# Altium schematic sheet STM32.SchDoc: STM32_and_Reference_Voltage_Circuits
size 431 x 279 mm; DrawnBy: Will Mensah; SheetNumber: 2; SheetTotal: 6
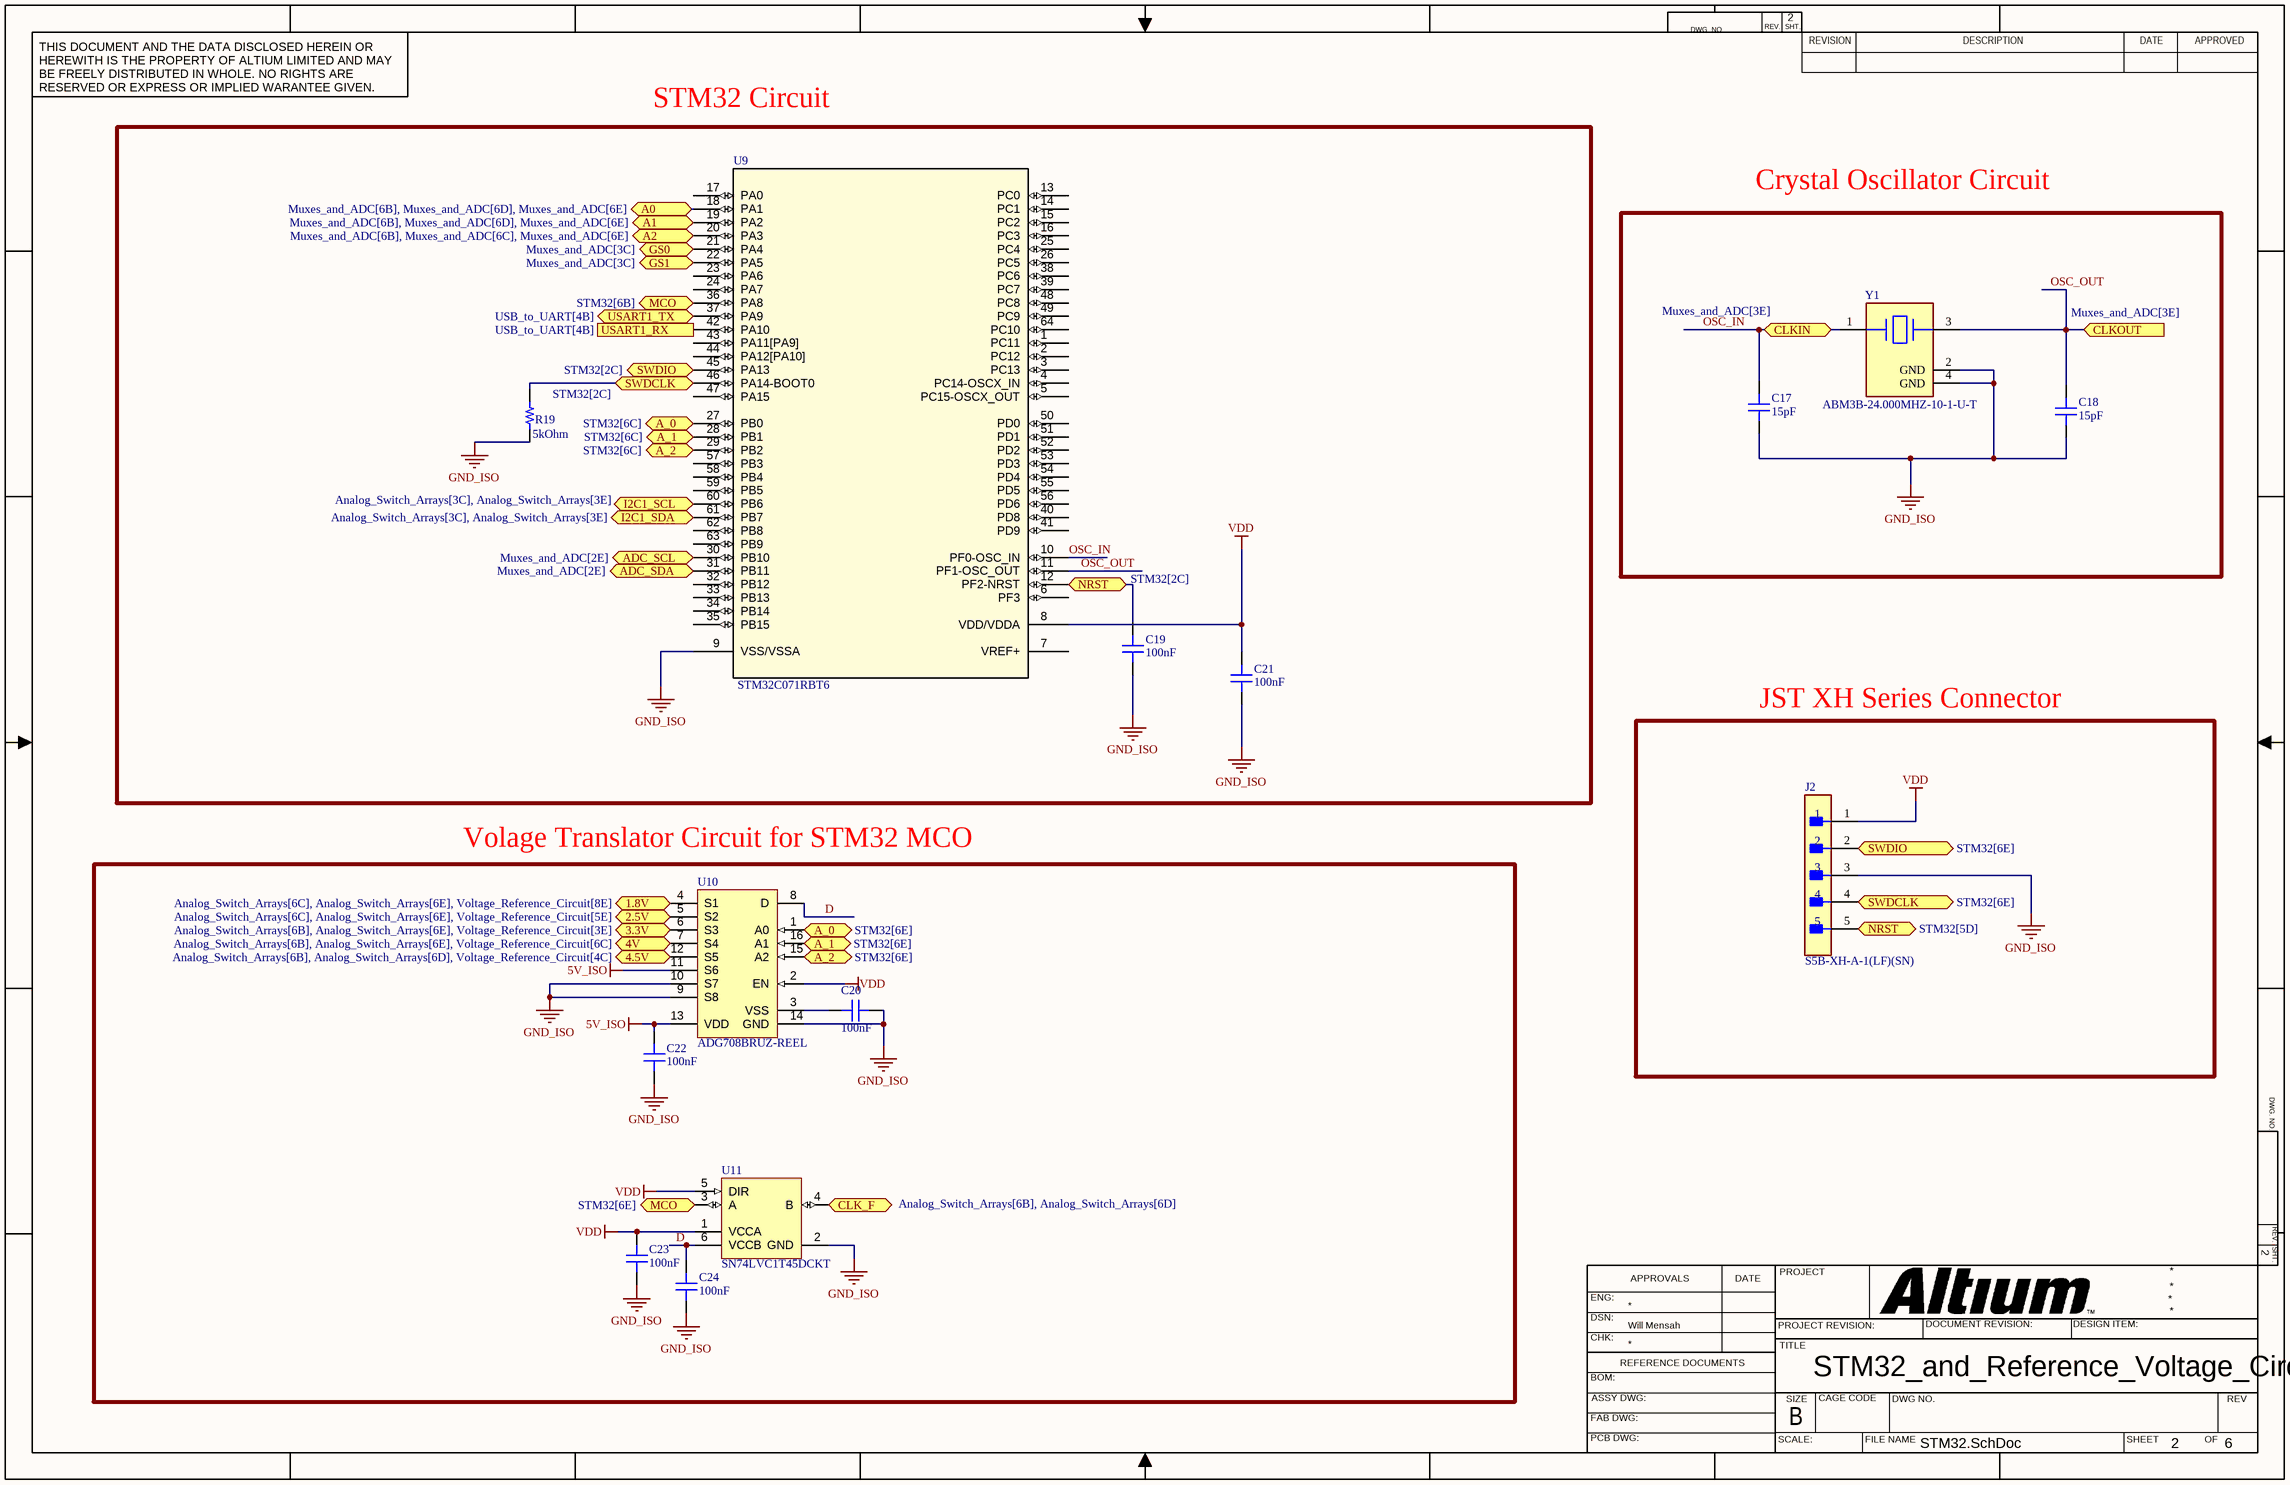
[diagram p0: STM32.SchDoc]

## Parts
C17  value 15pF  [MURATA CAP GRM31A 1206_3216]  (hidden comment: GRM31A5C2H150JW01D)
C18  value 15pF  [MURATA CAP GRM31A 1206_3216]  (hidden comment: GRM31A5C2H150JW01D)
C19  value 100nF  [MURATA CAP GCM31M 1206_3216]  (hidden comment: GCM31C5C1H104FA16L)
C20  value 100nF  [CAP 1206_3216 - 0.8MM]  (hidden comment: C1206X104G4HAC7800)
C21  value 100nF  [MURATA CAP GCM31M 1206_3216]  (hidden comment: GCM31C5C1H104FA16L)
C22  value 100nF  [CAP 1206_3216 - 0.8MM]  (hidden comment: C1206X104G4HAC7800)
C23  value 100nF  [CAP 1206_3216 - 0.8MM]  (hidden comment: C1206X104G4HAC7800)
C24  value 100nF  [CAP 1206_3216 - 0.8MM]  (hidden comment: C1206X104G4HAC7800)
J2  S5B-XH-A-1(LF)(SN)  [FP-S5B-XH-A-1_LF_SN-MFG]
R19  5kOhm  [YAGEO RES 1206_3216]
U9  STM32C071RBT6  [LQFP-64_STM]
U10  ADG708BRUZ-REEL  [ADI-RU-16_N]
U11  SN74LVC1T45DCKT  [DCK0006A_N]
Y1  ABM3B-24.000MHZ-10-1-U-T  [FP-ABM3B-MFG]

## Blocks framed on the sheet
STM32 Circuit: C19 C21 R19 U9
Crystal Oscillator Circuit: C17 C18 Y1
JST XH Series Connector: J2
Volage Translator Circuit for STM32 MCO: C20 C22-C24 U10 U11

## Ports
1.8V (bidir, see Analog_Switch_Arrays[6C], Analog_Switch_Arrays[6E], Voltage_Reference_Circuit[8E]), 2.5V (bidir, see Analog_Switch_Arrays[6C], Analog_Switch_Arrays[6E], Voltage_Reference_Circuit[5E]), 3.3V (bidir, see Analog_Switch_Arrays[6B], Analog_Switch_Arrays[6E], Voltage_Reference_Circuit[3E]), 4.5V (bidir, see Analog_Switch_Arrays[6B], Analog_Switch_Arrays[6D], Voltage_Reference_Circuit[4C]), 4V (bidir, see Analog_Switch_Arrays[6B], Analog_Switch_Arrays[6E], Voltage_Reference_Circuit[6C]), A0 (bidir, see Muxes_and_ADC[6B], Muxes_and_ADC[6D], Muxes_and_ADC[6E]), A1 (bidir, see Muxes_and_ADC[6B], Muxes_and_ADC[6D], Muxes_and_ADC[6E]), A2 (bidir, see Muxes_and_ADC[6B], Muxes_and_ADC[6C], Muxes_and_ADC[6E]), A_0 (bidir, see STM32[6C]), A_0 (bidir, see STM32[6E]), A_1 (bidir, see STM32[6C]), A_1 (bidir, see STM32[6E]), A_2 (bidir, see STM32[6C]), A_2 (bidir, see STM32[6E]), ADC_SCL (bidir, see Muxes_and_ADC[2E]), ADC_SDA (bidir, see Muxes_and_ADC[2E]), CLK_F (bidir, see Analog_Switch_Arrays[6B], Analog_Switch_Arrays[6D]), CLKIN (bidir, see Muxes_and_ADC[3E]), CLKOUT (in, see Muxes_and_ADC[3E]), GS0 (bidir, see Muxes_and_ADC[3C]), GS1 (bidir, see Muxes_and_ADC[3C]), I2C1_SCL (bidir, see Analog_Switch_Arrays[3C], Analog_Switch_Arrays[3E]), I2C1_SDA (bidir, see Analog_Switch_Arrays[3C], Analog_Switch_Arrays[3E]), MCO (bidir, see STM32[6B]), MCO (bidir, see STM32[6E]), NRST (bidir, see STM32[2C]), NRST (bidir, see STM32[5D]), SWDCLK (bidir, see STM32[2C]), SWDCLK (bidir, see STM32[6E]), SWDIO (bidir, see STM32[2C]), SWDIO (bidir, see STM32[6E]), USART1_RX (in, see USB_to_UART[4B]), USART1_TX (bidir, see USB_to_UART[4B])

## Nets
5V_ISO: C22.1 U10.11(S6) U10.13(VDD)
GND_ISO: C17.1 C18.2 C19.1 C20.2 C21.1 C22.2 C23.1 C24.1 J2.3 R19.1 U9.9(VSS/VSSA) U10.9(S8) U10.10(S7) U10.14(GND) U11.2(GND) Y1.2(GND) Y1.4(GND)
VDD: C21.2 C23.2 J2.1 U9.8(VDD/VDDA) U10.2(EN) U11.1(VCCA) U11.5(DIR)
1.8V: U10.4(S1) ; port 1.8V
2.5V: U10.5(S2) ; port 2.5V
3.3V: U10.6(S3) ; port 3.3V
4.5V: U10.12(S5) ; port 4.5V
4V: U10.7(S4) ; port 4V
A0: U9.18(PA1) ; port A0
A1: U9.19(PA2) ; port A1
A2: U9.20(PA3) ; port A2
A_0: U9.27(PB0) U10.1(A0) ; port A_0
A_1: U9.28(PB1) U10.16(A1) ; port A_1
A_2: U9.29(PB2) U10.15(A2) ; port A_2
ADC_SCL: U9.30(PB10) ; port ADC_SCL
ADC_SDA: U9.31(PB11) ; port ADC_SDA
CLK_F: U11.4(B) ; port CLK_F
D: C24.2 U10.8(D) U11.6(VCCB)
GS0: U9.21(PA4) ; port GS0
GS1: U9.22(PA5) ; port GS1
I2C1_SCL: U9.60(PB6) ; port I2C1_SCL
I2C1_SDA: U9.61(PB7) ; port I2C1_SDA
MCO: U9.36(PA8) U11.3(A) ; port MCO
NRST: C19.2 J2.5 U9.12(PF2-NRST) ; port NRST
OSC_IN: C17.2 U9.10(PF0-OSC_IN) Y1.1 ; port CLKIN
OSC_OUT: C18.1 U9.11(PF1-OSC_OUT) Y1.3 ; port CLKOUT
SWDCLK: J2.4 R19.2 U9.46(PA14-BOOT0) ; port SWDCLK
SWDIO: J2.2 U9.45(PA13) ; port SWDIO
USART1_RX: U9.42(PA10) ; port USART1_RX
USART1_TX: U9.37(PA9) ; port USART1_TX
NetC20_1: C20.1 U10.3(VSS)

Not connected (* = marked no-connect by the designer): U9 1(PC11) 2(PC12) 3(PC13) 4(PC14-OSCX_IN) 5(PC15-OSCX_OUT) 6(PF3) 7(VREF+) 13(PC0) 14(PC1) 15(PC2) 16(PC3) 17(PA0) 23(PA6) 24(PA7) 25(PC4) 26(PC5) 32(PB12) 33(PB13) 34(PB14) 35(PB15) 38(PC6) 39(PC7) 40(PD8) 41(PD9) 43(PA11[PA9]) 44(PA12[PA10]) 47(PA15) 48(PC8) 49(PC9) 50(PD0) 51(PD1) 52(PD2) 53(PD3) 54(PD4) 55(PD5) 56(PD6) 57(PB3) 58(PB4) 59(PB5) 62(PB8) 63(PB9) 64(PC10)

## Notes on the sheet
- DWG. NO.
- REV.
- SHT.
- THIS DOCUMENT AND THE DATA DISCLOSED HEREIN OR HEREWITH IS THE PROPERTY OF ALTIUM LIMITED AND MAY BE FREELY DISTRIBUTED IN WHOLE. NO RIGHTS ARE RESERVED OR EXPRESS OR IMPLIED WARANTEE GIVEN.
- REVISION
- DESCRIPTION
- DATE
- APPROVED
- ENG:
- APPROVALS
- PROJECT
- DSN:
- CHK:
- REFERENCE DOCUMENTS
- PROJECT REVISION:
- TITLE
- DOCUMENT REVISION:
- DESIGN ITEM:
- BOM:
- FAB DWG:
- PCB DWG:
- ASSY DWG:
- SCALE:
- SIZE
- B
- CAGE CODE
- FILE NAME
- DWG NO.
- SHEET
- OF
- REV

## Library data of the parts
C17 C18 = CMP-001-059711-1: CAP CER 15PF 500V C0G/NP0 1206; Part Number: GRM31A5C2H150JW01D
C19 C21 = CMP-001-060542-1: CAP CER 0.1UF 50V C0G/NP0 1206; Part Number: GCM31C5C1H104FA16L
C20 C22-C24 = CMP-001-063573-1: CAP CER 1206 0.1F 16V ULTRA STAB; Part Number: C1206X104G4HAC7800
J2 = CMP-17439-000362-1: CONN HEADER R/A 5POS 2.5MM; Number of Positions: 5; Voltage Rating: 250V; Contact Shape: Square; Number of Rows: 1; Lead Free: Lead Free; Contact Material: Brass; Termination: Press-Fit; Connector Type: Header; Contact Finish - Mating: TIN; Insulation Color: Natural; Packaging: Bulk; Min Operating Temperature: -25°C; Series: XH; Mount: Through Hole; Contact Type: Male Pin; Insulation Material: Nylon; Max Operating Temperature: 85°C; Pitch: 2.5mm; Fastening Type: Detent; Flammability Rating: UL94 V-0
R19 = CMP-009-077766-1: RES SMD 5K OHM 0.1% 1/4W 1206; Part Number: RT1206BRD075KL
U9 = CMP-031-00033-1: Mainstream Arm Cortex-M0+ MCU with 128 Kbytes of Flash memory, 24 Kbytes RAM, 48 MHz CPU, 2x USART, timers, ADC, comm. I/F, USB FS, 2-3.6V; Manufacturer_Name: STMicroelectronics; Copyright: Copyright (C) 2025 Ultra Librarian. All rights reserved.; Component Type: Standard; Pins: 64; Source: STM32C071RBT6.SchLib; Type: Type; RefDes: RefDes; Manufacturer_Part_Number: STM32C071RBT6; Design Item ID: STM32C071RBT6
U10 = CMP-0798-00195-1: 1.8 to 5.5 V / +/-2.5 V, CMOS Low Voltage 3 Ohm, 8-Channel Multiplexer, -40 to 125 degC, 16-pin SOP (RU-16), Reel; Manufacturer: Analog Devices; t transition (s): 14n; Bandwidth (Hz): 55M; Supply V Guar Performance: Dual_(+/-2.5V), Single_(+3V), Single_(+5V); Ron (ohms): 3; Max Analog Signal Range: Vss to Vdd; ComponentLink1URL: http://www.analog.com/en/index.html; ComponentLink3Description: Package Specification; Code_JEDEC: MO-153AB; ComponentLink2URL: http://www.analog.com/static/imported-files/data_sheets/ADG708_709.pdf; Packing: Reel; ComponentLink3URL: http:/www.analog.com/static/imported-files/packages/36244347913743854010197452789RU16.pdf; PackageVersion: Nov-02; ComponentLink2Description: Datasheet; ComponentLink1Description: Manufacturer URL; PackageReference: RU-16; DatasheetVersion: Rev. C; PackageDescription: 16-Pin Thin Shrink Small Outline Package, Body 5 x 4.4 mm, Pitch 0.65 mm; PartNumber: ADG708BRUZ-REEL; Mounting Technology: Surface Mount
U11 = CMP-0859-00457-3: Single-Bit Dual-Supply Bus Transceiver with Configurable Voltage Translation and 3-State Outputs, DCK0006A, SMALL T&R; Manufacturer: Texas Instruments; VCC(Max)(V): 5.5; F @ Nom Voltage(Max)(Mhz): 150; 3-State Output: Yes; Output Type: CMOS; tpd @ Nom Voltage(Max)(ns): 15.5,8,5.8,4.4; Schmitt Trigger: No; Rating: Catalog; Logic: True; ICC @ Nom Voltage(Max)(mA): 0.004; VCC(Min)(V): 1.65; Technology Family: LVC; Input Type: CMOS/TTL; Voltage(Nom)(V): 1.8,2.5,3.3,5; Output Drive (IOL/IOH)(Max)(mA): 32/-32; Bits(#): 1; Sub-Family: Dual Supply Translator; PackageReference: DCK0006A; Generic Part Number: SN74LVC1T45; Operating Temperature Range(C): -40 to 85; DatasheetVersion: SCES515K
Y1 = CMP-27762-006050-1: Crystal 24MHz ±10ppm 10pF SMD-4 5mm x 3.2mm; ESR (Equivalent Series Resistance): 50R; Radiation Hardening: No; Frequency Tolerance: 10ppm; Mount: Surface Mount; Termination: SMD/SMT; Length: 5mm; Load Capacitance: 10pF; Frequency Stability: 10ppm; Min Operating Temperature: -10°C; Resistor Type: Ceramic; Depth: 3.2mm; Operating Frequency: 24 MHz; Lead Free: Lead Free; Series: ABM3B; Max Operating Temperature: 60°C; Frequency: 24MHz; RoHS Compliant: Yes; Width: 0.126inch; Packaging: Tape and Reel; Case/Package: CSMD; Package Quantity: 1000; REACH SVHC: No SVHC; Height: 0.043inch; Tolerance: 10ppm; Number of Pins: 4